# EAGLE design encoder_only_board (EAGLE 9.4.2)

## Sheet 1 of 4
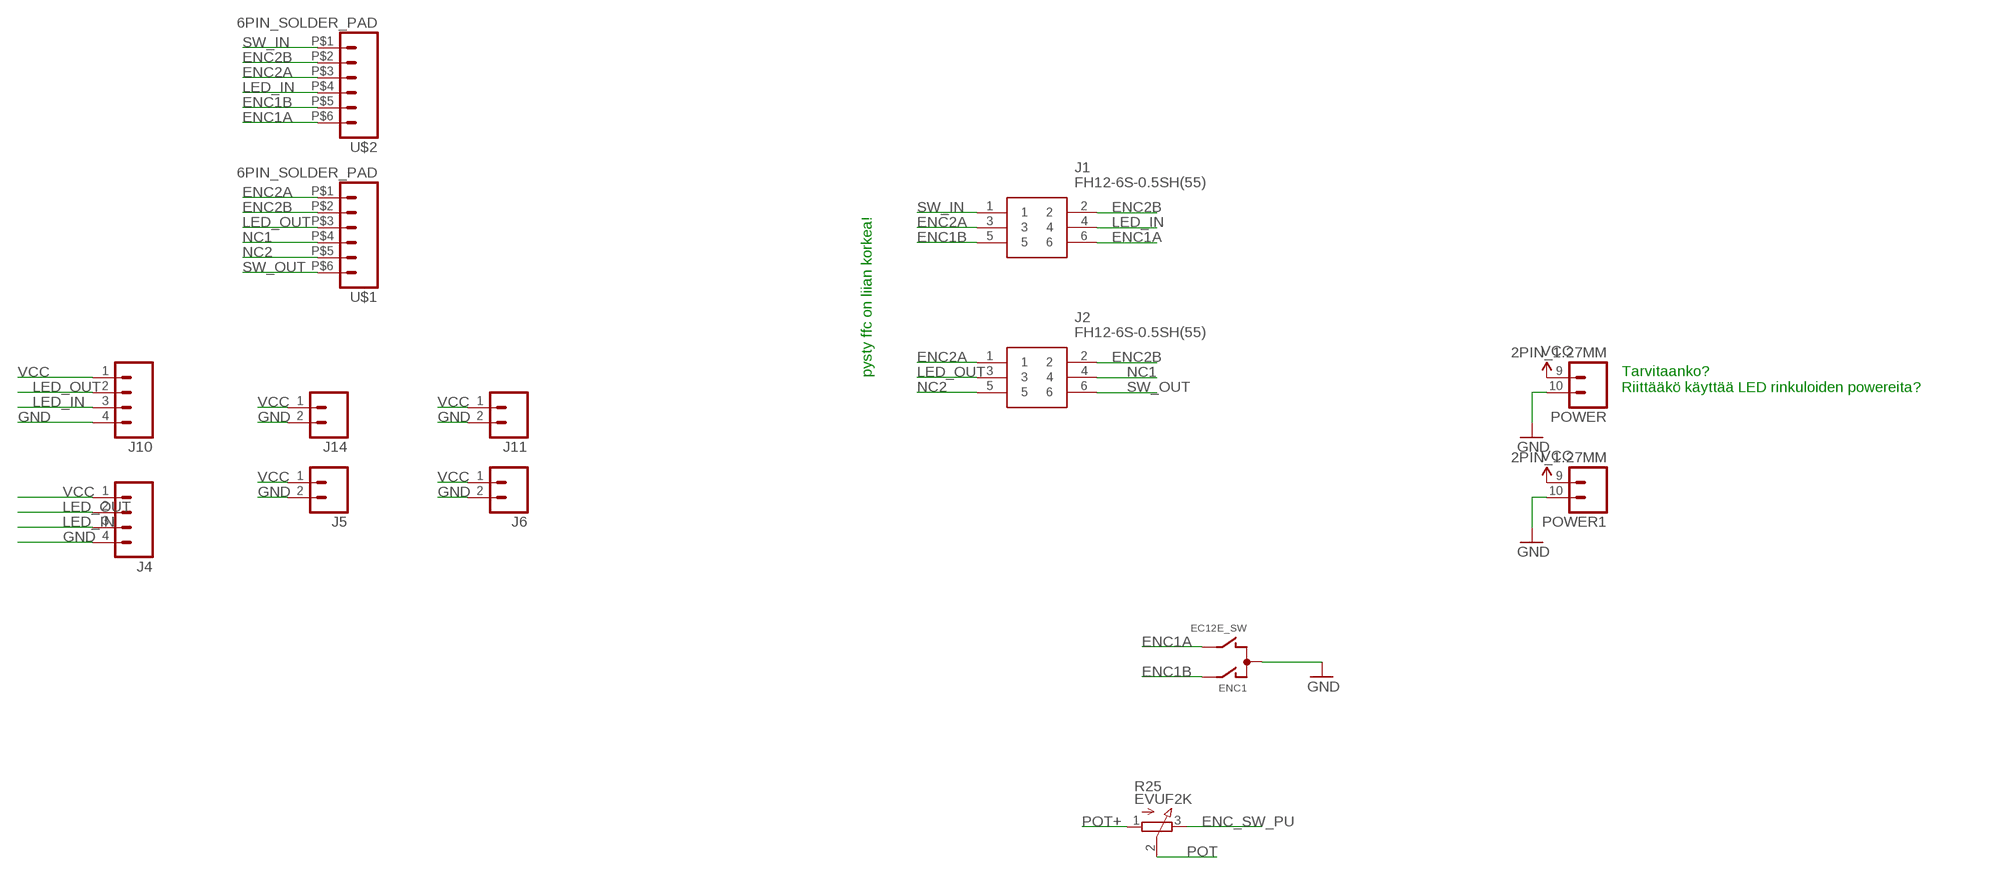
[diagram p0: schematic, sheet 1]

### Parts
ENC1  EC12E_SW  [ALPS_EC12E_SW]
J1  FH12-6S-0.5SH(55)  [FH12-6S-0.5SH(55)_1]
J2  FH12-6S-0.5SH(55)  [FH12-6S-0.5SH(55)_1]
J4  M04NO_SILK_ALL_ROUND  [1X04_NO_SILK_ALL_ROUND]
J5  M021X02_NO_SILK  [1X02_NO_SILK]
J6  M021X02_NO_SILK  [1X02_NO_SILK]
J10  M04NO_SILK_ALL_ROUND  [1X04_NO_SILK_ALL_ROUND]
J11  M021X02_NO_SILK  [1X02_NO_SILK]
J14  M021X02_NO_SILK  [1X02_NO_SILK]
POWER  2PIN_1.27MM  [1X02_1.27MM_NO_SILK]
POWER1  2PIN_1.27MM  [1X02_1.27MM_NO_SILK]
R25  EVUF2K  [EVUFXK]
U$1  6PIN_SOLDER_PAD  [6PIN_SOLDER_PAD]
U$2  6PIN_SOLDER_PAD  [6PIN_SOLDER_PAD]

### Nets
ENC1A: ENC1.B J1.6 U$2.P$6
ENC1B: ENC1.A J1.5 U$2.P$5
ENC2A: J1.3 J2.1 U$1.P$1 U$2.P$3 ; also sheet 3
ENC2B: J1.2 J2.2 U$1.P$2 U$2.P$2 ; also sheet 3
ENC_SW_PU: R25.3(E) ; also sheet 3,4
GND: ENC1.C J4.4 J5.2 J6.2 J10.4 J11.2 J14.2 POWER1.10 POWER.10 ; also sheet 2,4
LED_IN: J1.4 J4.3 J10.3 U$2.P$4 ; also sheet 3
LED_OUT: J2.3 J4.2 J10.2 U$1.P$3 ; also sheet 3
NC1: J2.4 U$1.P$4
NC2: J2.5 U$1.P$5
POT: R25.2(S) ; also sheet 3
POT+: R25.1(A) ; also sheet 3
SW_IN: J1.1 U$2.P$1 ; also sheet 3
SW_OUT: J2.6 U$1.P$6 ; also sheet 4
VCC: J4.1 J5.1 J6.1 J10.1 J11.1 J14.1 POWER1.9 POWER.9 ; also sheet 2,3,4
Unconnected: ENC1.GND1(G) ENC1.GND2(G)

### Notes on the sheet
- pysty ffc on liian korkea!
- Tarvitaanko?
  Riittääkö käyttää LED rinkuloiden powereita?

## Sheet 2 of 4
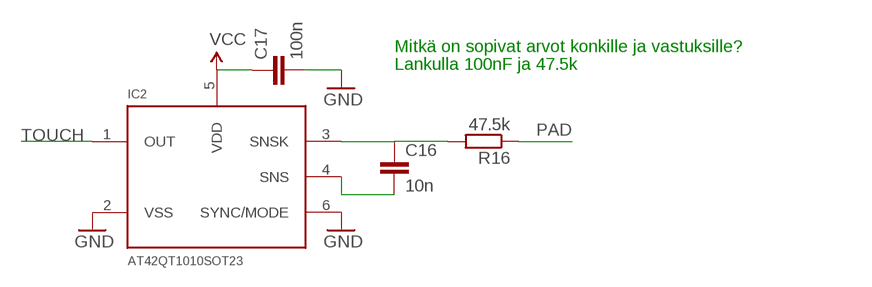
[diagram p1: schematic, sheet 2]

### Parts
C16  10n  CAP0603-CAP  [0603-CAP]
C17  100n  CAP0603-CAP  [0603-CAP]
IC2  AT42QT1010SOT23  [SOT23-6]
R16  47.5k  R-EU_R0603  [R0603]

### Nets
GND: C17.2 IC2.2(VSS) IC2.6(SYNC/MODE) ; also sheet 1,4
N$7: C16.1 IC2.3(SNSK) R16.2
N$15: C16.2 IC2.4(SNS)
PAD: R16.1
TOUCH: IC2.1(OUT) ; also sheet 3
VCC: C17.1 IC2.5(VDD) ; also sheet 1,3,4

### Notes on the sheet
- Mitkä on sopivat arvot konkille ja vastuksille?
- Lankulla 100nF ja 47.5k

## Sheet 3 of 4
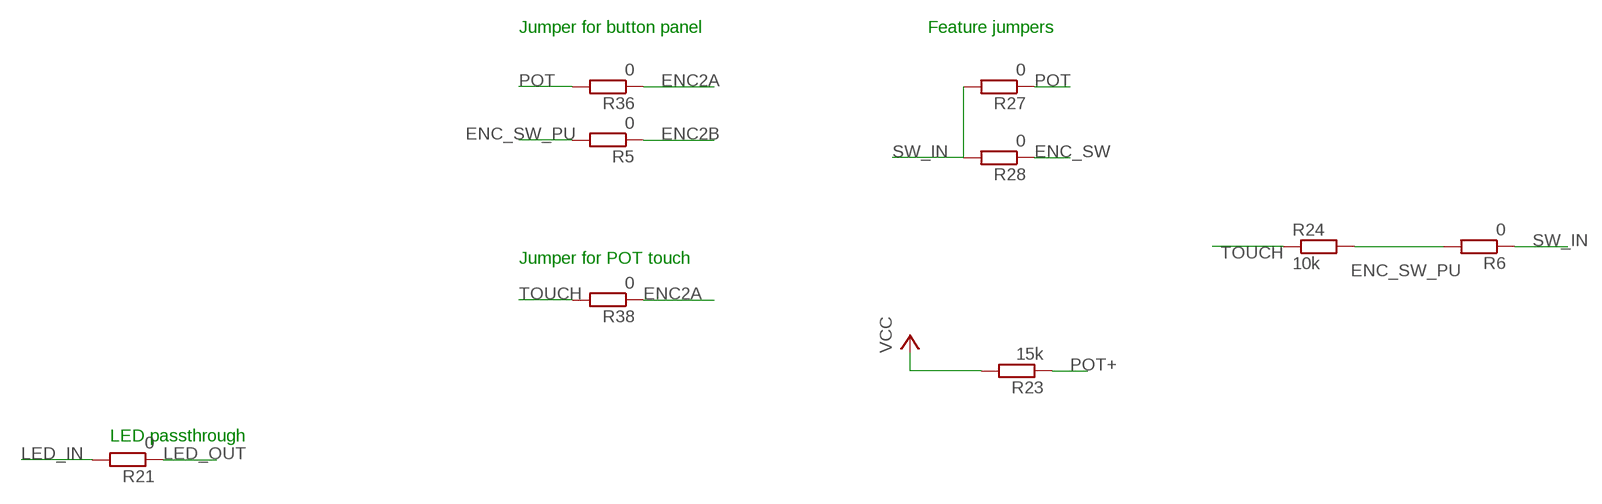
[diagram p2: schematic, sheet 3]

### Parts
R5  0  R-EU_R0603  [R0603]
R6  0  R-EU_R0603  [R0603]
R21  0  R-EU_R0603  [R0603]
R23  15k  R-EU_R0603  [R0603]
R24  10k  R-EU_R0603  [R0603]
R27  0  R-EU_R0603  [R0603]
R28  0  R-EU_R0603  [R0603]
R36  0  R-EU_R0603  [R0603]
R38  0  R-EU_R0603  [R0603]

### Nets
ENC2A: R36.1 R38.1 ; also sheet 1
ENC2B: R5.1 ; also sheet 1
ENC_SW: R28.1 ; also sheet 4
ENC_SW_PU: R5.2 R6.2 R24.2 ; also sheet 1,4
LED_IN: R21.2 ; also sheet 1
LED_OUT: R21.1 ; also sheet 1
POT: R27.1 R36.2 ; also sheet 1
POT+: R23.1 ; also sheet 1
SW_IN: R6.1 R27.2 R28.2 ; also sheet 1
TOUCH: R24.1 R38.2 ; also sheet 2
VCC: R23.2 ; also sheet 1,2,4

### Notes on the sheet
- Jumper for button panel | Feature jumpers
- Jumper for POT touch
- LED passthrough

## Sheet 4 of 4
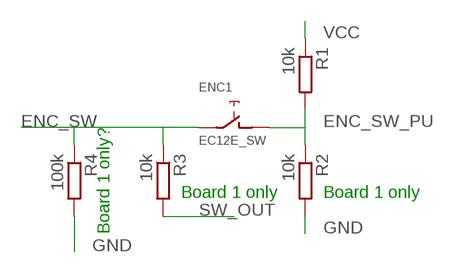
[diagram p3: schematic, sheet 4]

### Parts
R1  10k  R-EU_R0603  [R0603]
R2  10k  R-EU_R0603  [R0603]
R3  10k  R-EU_R0603  [R0603]
R4  100k  R-EU_R0603  [R0603]

### Nets
ENC_SW: ENC1.E R3.1 R4.1 ; also sheet 3
ENC_SW_PU: ENC1.D R1.2 R2.1 ; also sheet 1,3
GND: R2.2 R4.2 ; also sheet 1,2
SW_OUT: R3.2 ; also sheet 1
VCC: R1.1 ; also sheet 1,2,3

### Notes on the sheet
- Board 1 only | Board 1 only
- Board 1 only?

## Library data of the parts
C16 C17 = SparkFun-Capacitors:CAP: Capacitor Standard 0603 ceramic capacitor, and 0.1" leaded capacitor.
ENC1 = switch_pec:EC12E_SW: ALPS rotary Encoder EC12E series with switch; MPN: EC12E2424407; OC_FARNELL: 1520813; OC_NEWARK: 74M1068
IC2 = touch_sensor:AT42QT1010: Atmel AT42QT1010 The AT42QT1010 (QT1010) is a digital burst mode charge-transfer (QT™) sensor that is capable of detecting nearproximityor touch, making it ideal for implementing touch controls.The QT1010 is designed specifically for human interfaces, like control panels, appliances, toys, lighting controls, or anywhere a mechanical switch or button may be found. It includes all hardware and signal processing functions necessary to provide stable sensing under a wide variety of changing conditions. Only a single low-cost capacitor is required for operation. This chip is identical to the AT42QT1011, however the capsense times out after 60 seconds. Reciprocally, the capsense on the 1011 never times out. Reference "Signal Processing" in the datasheet. Datasheet <http://www.atmel.com/images/Atmel-9541-AT42-QTouch-BSW-AT42QT1010_Datasheet.pdf> Sparkfun Products Sparkfun Capacitive Touch Breakout <https://www.sparkfun.com/products/12041> (SEN-12041)
J1 J2 = FH12-6S-0.5SH(55):FH12-6S-0.5SH(55): HIROSE(HRS) - FH12-6S-0.5SH(55) - FFC/FPC CONNECTOR, RECEPTACLE, 6POS 1ROW Source: Datasheet <https://www.hirose.com/product/en/download_file/key_name/FH12-6S-0.5SH(55)/category/Drawing (2D)/doc_file_id/75611/?file_category_id=6&item_id=05860582555&is_series=>; DESCRIPTION: HIROSE(HRS) - FH12-6S-0.5SH(55) - FFC/FPC CONNECTOR, RECEPTACLE, 6POS 1ROW; HEIGHT: mm; MANUFACTURER_NAME: Hirose; MANUFACTURER_PART_NUMBER: FH12-6S-0.5SH(55); MOUSER_PART_NUMBER: 798-FH12-6S-0.5SH55; MOUSER_PRICE-STOCK: https://www.mouser.com/Search/Refine.aspx?Keyword=798-FH12-6S-0.5SH55; RS_PART_NUMBER: 7388811P; RS_PRICE-STOCK: http://uk.rs-online.com/web/p/products/7388811P
J4 J10 = i2c_encoder:M04: Header 4 Standard 4-pin 0.1" header. Use with straight break away headers (SKU : PRT-00116), right angle break away headers (PRT-00553), swiss pins (PRT-00743), machine pins (PRT-00117), and female headers (PRT-00115). Molex polarized connector foot print use with SKU : PRT-08231 with associated crimp pins and housings. 1MM SMD Version SKU: PRT-10208; PROD_ID: CONN-09696
J5 J6 J11 J14 = i2c_encoder:M02: Standard 2-pin 0.1" header. Use with - straight break away headers ( PRT-00116) - right angle break away headers (PRT-00553) - swiss pins (PRT-00743) - machine pins (PRT-00117) - female headers (PRT-00115) Molex polarized connector foot print use with: PRT-08233 with associated crimp pins and housings. 2.54_SCREWTERM for use with PRT-10571. 3.5mm Screw Terminal footprints for PRT-08084 5mm Screw Terminal footprints for use with PRT-08432
POWER POWER1 = edge:2PIN_1.27MM
R1-R6 R23 R24 R27 R28 R36 R38 = rcl:R-EU_: RESISTOR, European symbol; SPICEPREFIX: R
R16 R21 = rcl:R-EU_: RESISTOR, European symbol
R25 = i2c_encoder:EVU: Potentiometer modified from "9 mm Square Rotary Potentiometers (Source: Panasonic)"
U$1 U$2 = edge:6PIN_SOLDER_PAD

## Board
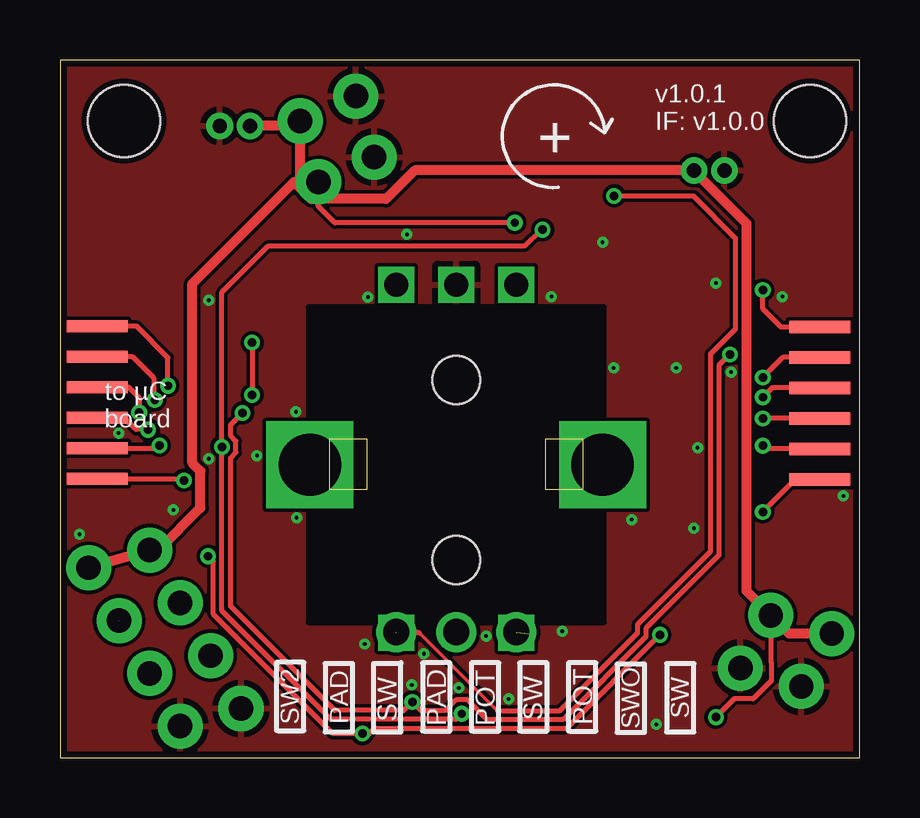
[diagram p4: board, top side]
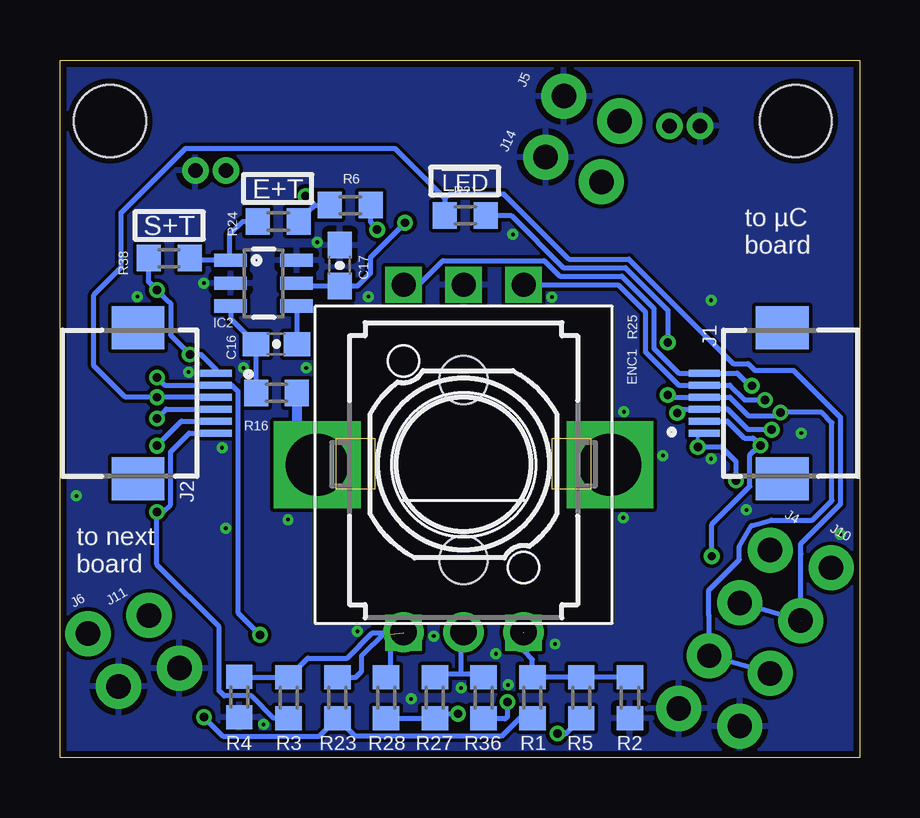
[diagram p5: board, bottom side, seen from below]

Size 33.32 x 29.08 mm. Coordinates in mm from the lower left corner, seen from the top.
Outline: 0,0 33.33,0 33.33,29.08 0,29.08 0,0
Copper layers (1*16): Top 0.035mm / dielectric 1.5mm / Bottom 0.035mm
Design rules "SeeedStudio_2layer_DRU_no_angle_20140221": minimum track width 6mil, minimum drill 12mil, track to track 6mil, track to pad 6mil, pad to pad 6mil, via to via 6mil, smd to smd 0mil, copper to edge 10mil, drill to drill 10mil, minimum pad ring 10mil, minimum via ring 6mil, stop-mask expansion 2mil, vias tented up to drill 100mil, thermal gap 10mil
Holes 3 mm at 31.24,26.54 2.67,26.54
tRestrict: area 10.3,5.6 to 22.7,18.8
bRestrict: area 10.3,5.6 to 22.7,18.8

### Footprints (pad centres in the part's own frame; a part is rotated, then mirrored left to right if it is on the bottom)
0603-CAP = smd 1.1 x 1: 1 -0.85,0; 2 0.85,0
ALPS_EC12E_SW = drill 1 square: A -2.5,-7.5; B 2.5,-7.5; C 0,-7.5; D -2.5,7; E 2.5,7 | drill 2.6 square: GND1 -6.1,0; GND2 6.1,0
SOT23-6 = smd 0.55 x 1.35: 1 -0.95,-1.375; 2 0,-1.375; 3 0.95,-1.375; 4 0.95,1.375; 5 0,1.375; 6 -0.95,1.375
FH12-6S-0.5SH(55)_1 = smd 0.3 x 1.3: 1 -1.25,0; 2 -0.75,0; 3 -0.25,0; 4 0.25,0; 5 0.75,0; 6 1.25,0 | smd 1.8 x 2.2: 7 -3.15,-3.25; 8 3.15,-3.25
1X04_NO_SILK_ALL_ROUND = drill 1.016 pad 1.88: 1 0,0; 2 2.54,0; 3 5.08,0; 4 7.62,0
1X02_NO_SILK = drill 1.016 pad 1.88: 1 0,0; 2 2.54,0
1X02_1.27MM_NO_SILK = drill 0.6: 9 0,0; 10 1.27,0
R0603 = smd 1 x 1.1: 1 -0.85,0; 2 0.85,0
EVUFXK = drill 1.1 pad 1.676: 1 -2.5,-7; 2 0,-7; 3 2.5,-7 | hole 2: 0,3.5; 0,-4
6PIN_SOLDER_PAD = smd 0.508 x 2.54: P$1 0,0; P$2 1.27,0; P$3 2.54,0; P$4 3.81,0; P$5 5.08,0; P$6 6.35,0

### Placement (x,y rotation side)
C16  24.31,17.25 0 bottom
C17  21.67,20.52 90 bottom
ENC1  16.51,12.22 180 bottom
IC2  24.84,19.79 270 bottom
J1  6.48,14.78 90 bottom
J2  26.82,14.78 270 bottom
J4  3.73,8.66 240 bottom
J5  10.01,26.54 156 bottom
J6  32.16,5.18 300 bottom
J10  1.19,7.92 240 bottom
J11  29.62,5.94 300 bottom
J14  10.77,24 156 bottom
POWER  7.92,26.34 0 bottom
POWER1  26.42,24.49 0 top
R1  13.64,2.51 90 bottom
R2  9.58,2.51 270 bottom
R3  23.8,2.51 270 bottom
R4  25.86,2.54 270 bottom
R5  11.61,2.51 90 bottom
R6  21.23,23.04 180 bottom
R16  24.31,15.21 180 bottom
R21  16.43,22.61 0 bottom
R23  21.77,2.51 270 bottom
R24  24.23,22.35 0 bottom
R25  16.51,12.24 0 bottom
R27  17.7,2.51 270 bottom
R28  19.74,2.51 270 bottom
R36  15.67,2.51 90 bottom
R38  28.78,20.83 0 bottom
U$1  31.65,17.96 270 top
U$2  1.55,11.63 90 top

### Tracks (layer width: path | path; a pad name or v marks a point on that pad's centre or on a via)
ENC1A  (via drill 0.35)
  Top 0.203: v4.5,15.51 4.5,16.68 3.2,17.98 U$2.P$6
  Bottom 0.203: ENC1.B 18.38,19.72 17.37,20.73 13.15,20.73 12.5,20.07 9.92,20.07 8.58,18.74 8.58,17.07 7.54,16.03 J1.6 6.37,16.04 5.11,16.04 4.58,15.51 v4.5,15.51
ENC1B  (via drill 0.35)
  Top 0.203: v3.95,14.92 3.95,15.16 3.92,15.19 3.92,15.82 3.02,16.71 U$2.P$5
  Bottom 0.203: ENC1.A 10.06,19.72 8.94,18.59 8.94,16.92 7.55,15.53 J1.5 6.37,15.54 5.42,15.54 4.8,14.92 v3.95,14.92
ENC2A  (via drill 0.35)
  Top 0.203: v29.28,19.49 29.28,18.73 30.05,17.96 U$1.P$1 | U$2.P$3 2.68,14.17 3.16,13.69 3.66,13.69 v3.67,13.68 3.68,13.69 | v27.91,16.82 27.46,16.36 27.46,8.45 24.41,5.41 24.41,5.06 20.96,1.6 17.8,1.6 16.98,2.42 16.5,2.42 16.04,1.97 15.05,1.97 v14.68,2.34 14.33,1.98 11.45,1.98 7.11,6.32 7.11,12.49 7.33,12.72 7.33,13.2 7.11,13.43 7.11,13.88 v7.61,14.38
  Bottom 0.203: J2.1 26.82,16.18 27.46,16.82 v27.91,16.82 28.72,17.62 28.72,18.94 28.87,19.09 28.88,19.09 v29.28,19.49 29.28,19.5 29.63,19.85 R38.1 | v3.67,13.68 4.66,13.68 5.51,14.53 J1.3 7.45,14.53 v7.61,14.38 | v14.68,2.34 14.68,1.73 14.78,1.63 15.63,1.63 R36.1
ENC2B  (via drill 0.35)  (1 unrouted)
  Top 0.203: v24.99,5.13 21.11,1.25 13.12,1.25 12.89,1.02 v12.6,1.02 11.37,1.02 6.39,5.99 6.39,8.18 v6.17,8.41 | U$1.P$2 30.12,16.69 v29.28,15.86 | U$2.P$2 4.02,12.9 v4.14,13.02
  Bottom 0.203: v25,5.13 25.92,6.05 25.92,15.29 26.17,15.54 J2.2 28.96,15.53 v29.28,15.86 | v12.6,1.02 12.26,1.02 R5.1 | J1.2 5.51,14.03 4.8,13.32 4.45,13.32 v4.14,13.02 4.38,12.79 4.43,12.79 4.58,12.64 4.58,11.32 6.17,9.73 v6.17,8.41
ENC_SW  (1 unrouted)
  Bottom 0.203: R28.1 19.56,3.54 19.56,5.16 | R4.1 25.83,3.37 R3.1 23,4.17 21.36,4.17 20.31,5.22 ENC1.E
ENC_SW_PU  (via drill 0.35)  (1 unrouted)
  Top 0.152: 18.24,1.96 14.97,5.22
  Top 0.203: v23.09,23.42 26.39,23.42 28.14,21.67 28.14,17.87 27.1,16.82 27.1,8.59 24.06,5.55 24.06,5.2 20.81,1.96 18.24,1.96 | 14.97,5.22 ENC1.D
  Bottom 0.203: R24.2 22.77,22.97 | 22.77,22.97 22.7,23.04 R6.2 | 22.77,22.97 22.77,23.09 v23.09,23.42 | R2.1 R5.2 R1.2 13.64,4.1 14.01,4.47 ENC1.D
GND  (via drill 0.15)
  other vias: 12.83,19.2 20.47,19.23 22.61,21.49 23.06,16.26 23.83,9.93 17.75,5.08 25.68,16.26 32.64,10.92 14.45,21.82 30.1,19.23 8.2,12.6 6.2,12.47 12.7,4.75 26.57,12.93 9.86,10.01 9.83,14.43 27.33,19.79 20.93,5.28 27.97,16.08 26.42,9.58 18.69,2.46 24.84,1.4 16.61,2.92 15.16,4.34 14.66,3.05 6.2,19.08 2.44,13.54 4.72,10.34 0.81,9.32
  pour Top: 0,29.08 33.32,29.08 33.32,0 0,0
  pour Bottom: 0,29.08 33.32,29.08 33.32,0 0,0
LED_IN  (via drill 0.35)
  Top 0.203: v8,17.31 v8,15.13 8,15.06 | v3.3,14.4 3.3,15.01 2.87,15.44 U$2.P$4
  Bottom 0.203: J10.3 J4.3 6.27,5.92 6.29,5.93 6.29,6.99 5.01,8.26 5.01,8.83 4.52,9.69 3.68,9.91 1.97,9.91 1.16,10.72 1.16,13.97 1.59,14.4 v3.3,14.4 3.44,14.26 4.64,14.26 5.41,15.03 J1.4 7.91,15.03 v8,15.13 | R21.2 14.53,22.61 12.35,20.43 9.77,20.43 8,18.66 v8,17.31
LED_OUT  (via drill 0.35)  (1 unrouted)
  Top 0.203: U$1.P$3 29.67,15.42 v29.28,15.03
  Bottom 0.203: J4.2 J10.2 2.46,8.05 2.48,8.09 2.46,8.11 2.46,8.47 2.45,8.49 2.46,8.53 2.46,8.92 0.81,10.58 0.81,14.19 2.77,16.15 4.37,16.15 4.66,16.44 5.28,16.44 9.62,20.78 12.12,20.78 14.83,23.5 17.11,23.5 17.28,23.32 | 17.28,23.32 19.37,25.4 28.09,25.4 30.78,22.71 30.78,20.42 31.91,19.29 31.91,16.34 30.6,15.03 v29.28,15.03 J2.3 | 17.28,23.32 R21.1
N$7
  Bottom 0.203: IC2.3 26.22,18.3 C16.1 R16.2
N$15
  Bottom 0.203: IC2.4 C16.2
NC1  (via drill 0.35)
  Top 0.203: U$1.P$4 v29.28,14.15
  Bottom 0.203: v29.28,14.15 28.9,14.53 J2.4
NC2  (via drill 0.35)
  Top 0.203: U$1.P$5 29.42,12.88 v29.28,13.01
  Bottom 0.203: v29.28,13.01 28.26,14.03 J2.5
PAD
  Bottom 0.406: R16.1 23.47,13.74
POT
  Bottom 0.203: R27.1 17.55,3.52 16.64,3.52 | 16.64,3.52 15.82,3.52 R36.2 | R25.2 16.64,5.12 16.64,3.52
POT+
  Bottom 0.203: R25.1 19.77,5.24 20.76,4.25 20.76,3.6 20.99,3.37 R23.1
SW_IN  (via drill 0.35)
  Top 0.203: v16.74,1.84 16.51,1.61 11.27,1.61 6.75,6.14 v6.75,12.96 6.75,19.4 8.69,21.34 19.36,21.34 20.04,22.01 v20.11,22.01 | U$2.P$1 5.1,11.63 v5.16,11.57
  Bottom 0.152: R27.2 17.53,1.84 | v6.75,12.96 6.75,13.53 J1.1
  Bottom 0.203: 17.53,1.84 v16.74,1.84 | R28.2 R27.2 | R6.1 20.38,22.33 20.11,22.05 v20.11,22.01 | v6.75,12.96 5.77,12.96 5.16,12.35 v5.16,11.57
SW_OUT  (via drill 0.35)
  Top 0.203: U$1.P$6 30.64,11.61 v29.28,10.25
  Bottom 0.203: J2.6 26.87,13.48 26.92,13.54 27.94,13.54 28.72,12.76 28.72,10.56 29.03,10.25 v29.28,10.25 29.28,8.05 26.69,5.46 26.69,2.79 26.49,2.58 25.34,2.58 24.42,1.67 R3.2
TOUCH
  Bottom 0.203: R38.2 27.82,20.72 27.8,20.74 IC2.1 26.26,20.78 26.26,21.8 25.72,22.35 R24.1
VCC  (via drill 0.35)
  Top 0.203: v18.95,22.3 11.46,22.3 10.77,22.99 J14.1 9.75,24 | v27.33,1.7 28.09,2.46 28.88,2.46 29.63,3.21 29.63,4 29.62,4.01 J11.1
  Top 0.406: J10.1 J4.1 4.09,8.66 5.84,10.42 5.84,11.95 5.51,12.29 5.51,19.76 9.75,24 10.01,23.75 J5.1 9.8,26.34 POWER.9 | 26.39,24.49 28.6,22.28 28.6,6.96 J11.1 30.38,5.18 J6.1 | 26.39,24.49 14.78,24.49 13.59,23.29 10.46,23.29 10.77,23.6 J14.1 | POWER1.9 26.39,24.49
  Bottom 0.203: IC2.5 23.35,19.67 C17.1 21.65,19.66 20.93,19.66 20.4,20.19 20.4,20.85 v18.95,22.3 | R1.1 14.17,1.67 14.93,0.91 21.01,0.91 R23.2 22.52,0.91 26.54,0.91 v27.33,1.7

### Text on the board
tPlace: + | SW | SW | SW | SW2 | PAD | PAD | POT | POT | SWO
bPlace: !LED | E+T | S+T | to next / board
tNames: v1.0.1 / IF: v1.0.0 | to µC / board
bNames: to µC / board
Document: the height of an SK6812 is 1.6mm where / as the height for a smd encoder is ~4.5mm | use WS2812B or SK6812 to save on gpio pins | GPIO needed: / I2C: 2 / SPI: 4 (+ interrupt?) / encoder: 2 / leds: 1 / = 5 - 7(/8) | 0.5mm FFC max current = 0.55A / http://www.axon-cable.com/publications/FFC-Flat-Cables.pdf | F+M headerit päällekkäin on noin 5.1mm? | kooderin korkeus 4+(5-7 kierteet)mm